# EAGLE design SparkFun_SOT23-DIP-Adapter-v10 (EAGLE 7.2.0)
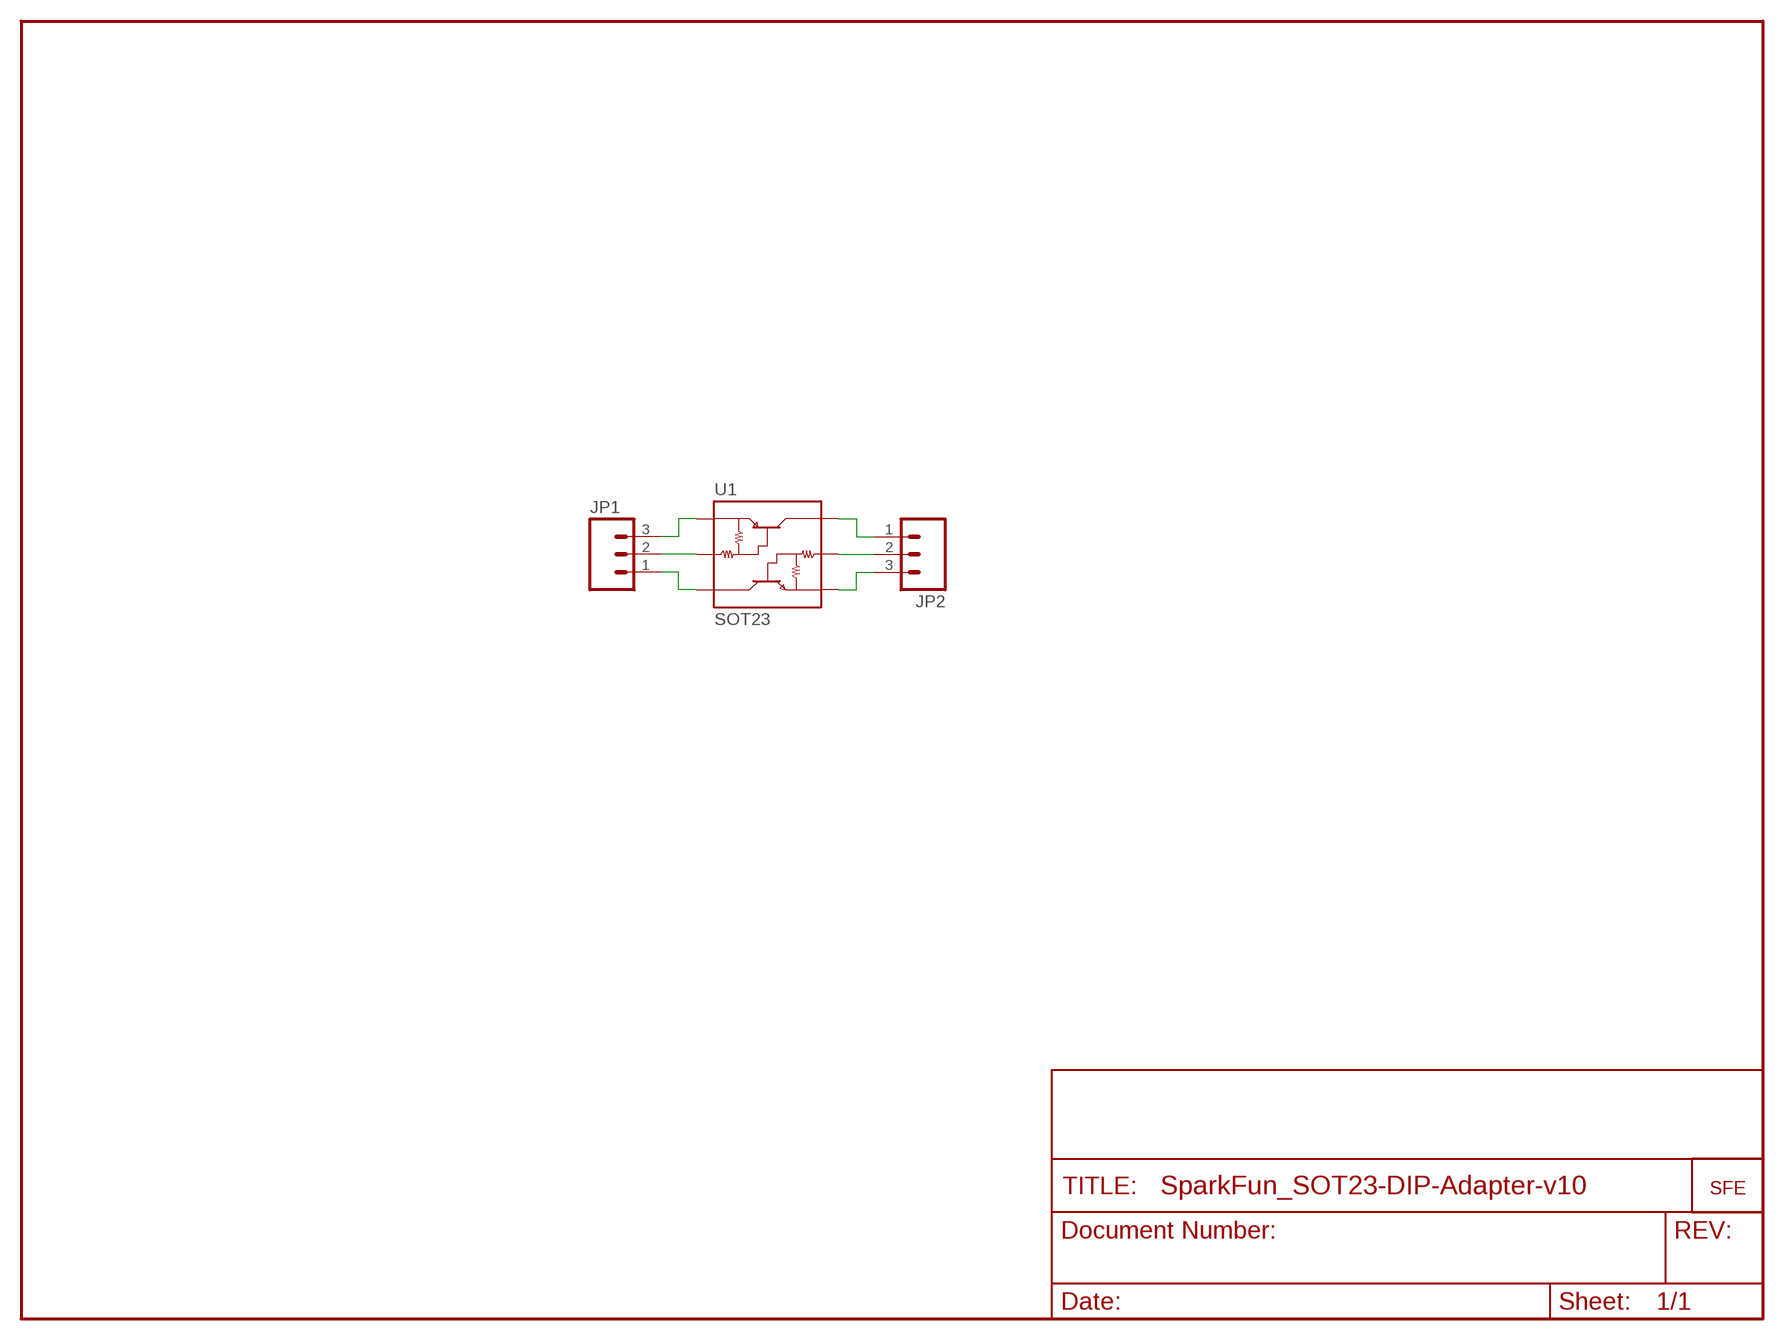
[diagram p0: schematic, sheet 1]

## Parts
JP1  M03PTH  [1X03]
JP2  M03PTH  [1X03]
U1  SOT23  XN04312SOT  [SOT23-6]
U$1  LOGO-SFESK  [SFE-LOGO-FLAME]

## Nets
N$1: JP2.1 U1.4(C2)
N$2: JP2.2 U1.5(B1)
N$3: JP2.3 U1.6(E1)
N$4: JP1.3 U1.3(E2)
N$5: JP1.2 U1.2(B2)
N$6: JP1.1 U1.1(C1)

## Library data of the parts
JP1 JP2 = SparkFun:M03: Header 3 Standard 3-pin 0.1" header. Use with straight break away headers (SKU : PRT-00116), right angle break away headers (PRT-00553), swiss pins (PRT-00743), machine pins (PRT-00117), and female headers (PRT-00115). Molex polarized connector foot print use with SKU : PRT-08232 with associated crimp pins and housings.
U1 = SparkFun:XN04312: NPN/PNP Transistor Array Handy dandy transistor array for level shifting and inverting signals. Spark Fun Electronics SKU : COM-00588
U$1 = SparkFun:LOGO-SFE: Spark Fun Electronics PCB Logo This is the standard Spark Fun Electronics PCB logo.

## Board
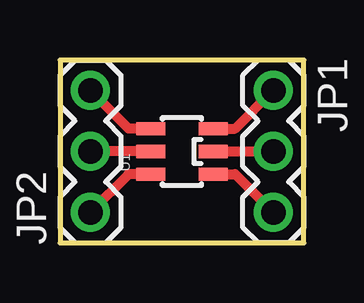
[diagram p1: board, top side]
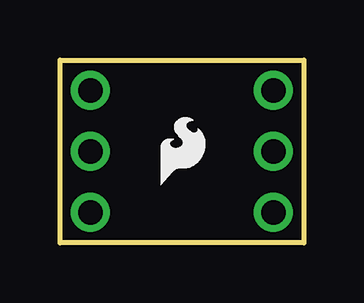
[diagram p2: board, bottom side, seen from below]

Size 10.16 x 7.62 mm. Coordinates in mm from the lower left corner, seen from the top.
Outline: 0,0 10.16,0 10.16,7.62 0,7.62 0,0
Copper layers (1*16): Top 0.0356mm / dielectric 1.5011mm / Bottom 0.0356mm
Design rules "default *": minimum track width 8mil, minimum drill 20mil, track to track 8mil, track to pad 8mil, pad to pad 8mil, via to via 8mil, smd to smd 8mil, copper to edge 10mil, drill to drill 8mil, minimum pad ring 12mil, minimum via ring 10mil, stop-mask expansion 4mil, vias tented up to drill 20mil, thermal gap 10mil

### Footprints (pad centres in the part's own frame; a part is rotated, then mirrored left to right if it is on the bottom)
1X03 = drill 1.016: 1 0,0; 2 2.54,0; 3 5.08,0
SOT23-6 = smd 0.55 x 1.2: 1 0.95,-1.3; 2 0,-1.3; 3 -0.95,-1.3; 4 -0.95,1.3; 5 0,1.3; 6 0.95,1.3

### Placement (x,y rotation side)
JP1  8.89,6.35 270 top
JP2  1.27,1.27 90 top
U1  5.08,3.81 90 top
U$1  5.97,2.41 0 bottom

### Tracks (layer width: path | path; a pad name or v marks a point on that pad's centre or on a via)
N$1
  Top 0.406: U1.4 2.86,2.86 JP2.1
N$2
  Top 0.406: U1.5 JP2.2
N$3
  Top 0.406: U1.6 2.86,4.76 JP2.3
N$4
  Top 0.406: U1.3 7.3,2.86 JP1.3
N$5
  Top 0.406: U1.2 JP1.2
N$6
  Top 0.406: U1.1 7.3,4.76 JP1.1